# EAGLE design RFM98PW (EAGLE 9.6.2)
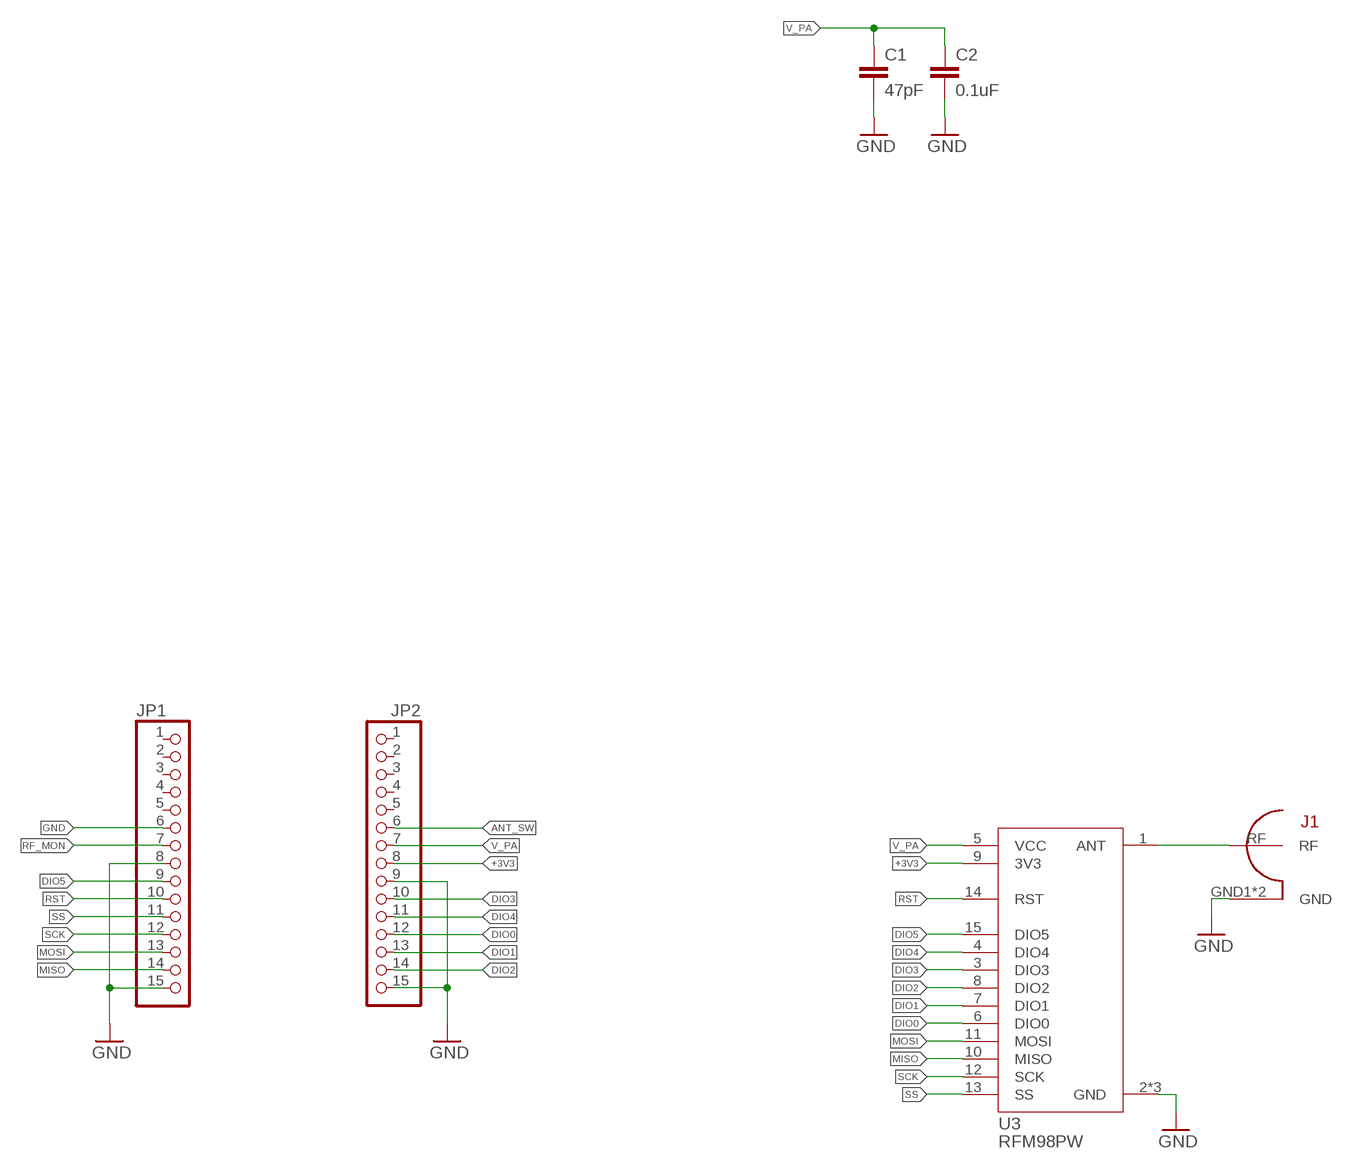
[diagram p0: schematic, sheet 1]

## Parts
C1  47pF  0603_CAPACITOR  [0603]
C2  0.1uF  0603_CAPACITOR  [0603]
J1  CON-SMA-EDGE-S  [CON-SMA-EDGE-S]
JP1  PINHD-1X15  [1X15]
JP2  PINHD-1X15  [1X15]
U3  RFM98PW  [RFM98PW]

## Nets
+3V3: JP2.8 U3.9(3V3)
ANT_SW: JP2.6
DIO0: JP2.12 U3.6(DIO0)
DIO1: JP2.13 U3.7(DIO1)
DIO2: JP2.14 U3.8(DIO2)
DIO3: JP2.10 U3.3(DIO3)
DIO4: JP2.11 U3.4(DIO4)
DIO5: JP1.9 U3.15(DIO5)
GND: C1.2 C2.2 J1.GND1(GND) J1.GND2(GND) JP1.6 JP1.8 JP1.15 JP2.9 JP2.15 U3.2(GND) U3.16(GND) U3.17(GND)
MISO: JP1.14 U3.10(MISO)
MOSI: JP1.13 U3.11(MOSI)
N$22 [RF]: J1.RF U3.1(ANT)
RF_MON: JP1.7
RST: JP1.10 U3.14(RST)
SCK: JP1.12 U3.12(SCK)
SS: JP1.11 U3.13(SS)
V_PA: C1.1 C2.1 JP2.7 U3.5(VCC)
Unconnected: JP1.1 JP1.2 JP1.3 JP1.4 JP1.5 JP2.1 JP2.2 JP2.3 JP2.4 JP2.5

## Library data of the parts
C1 C2 = ruark2:0603_CAPACITOR: 0603 Capacitor -- WARNING: NO DEFINED VALUE OR PART NUMBER; VALUE: sel
J1 = ruark2:CON-SMA-EDGE-S: SMA Connector Jack, Female Socket Board Edge, End Launch Solder; PARTNO: CON-SMA-EDGE-S-ND
JP1 JP2 = pinhead:PINHD-1X15: PIN HEADER
U3 = ruark2:RFM98PW: 433 MHz 1W LoRa Module

## Net classes
1 RF: clearance 0.127 mm

## Board
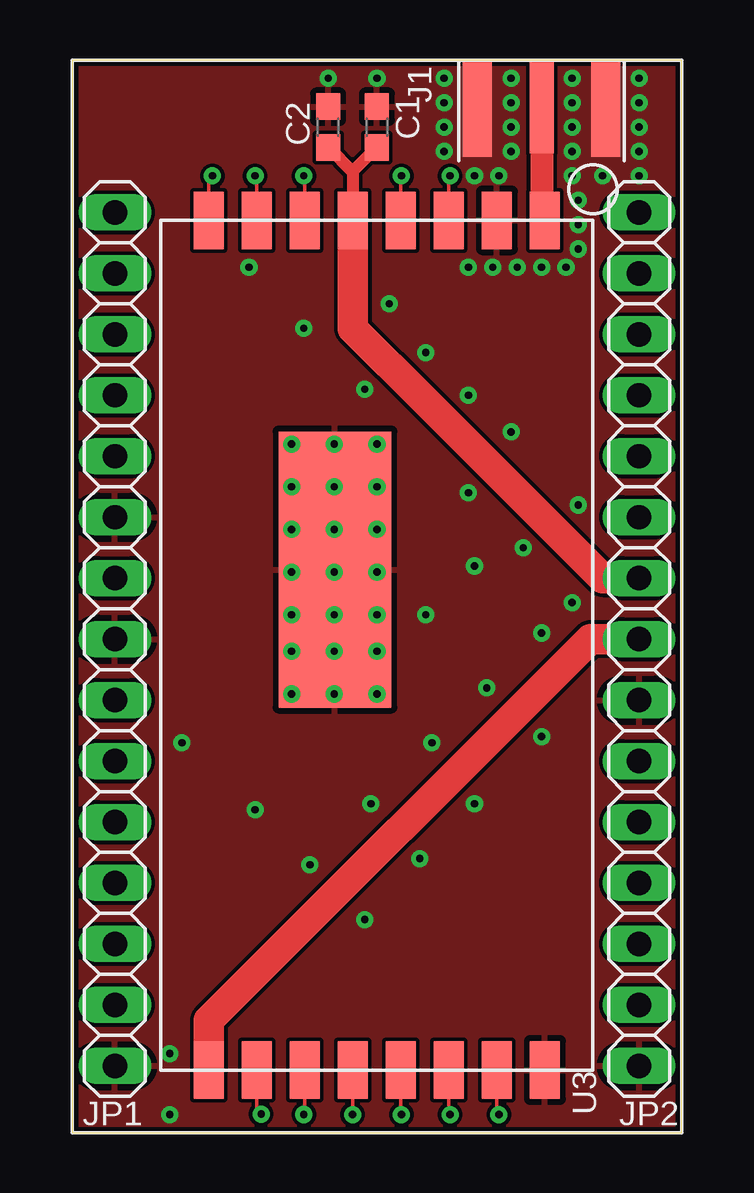
[diagram p1: board, top side]
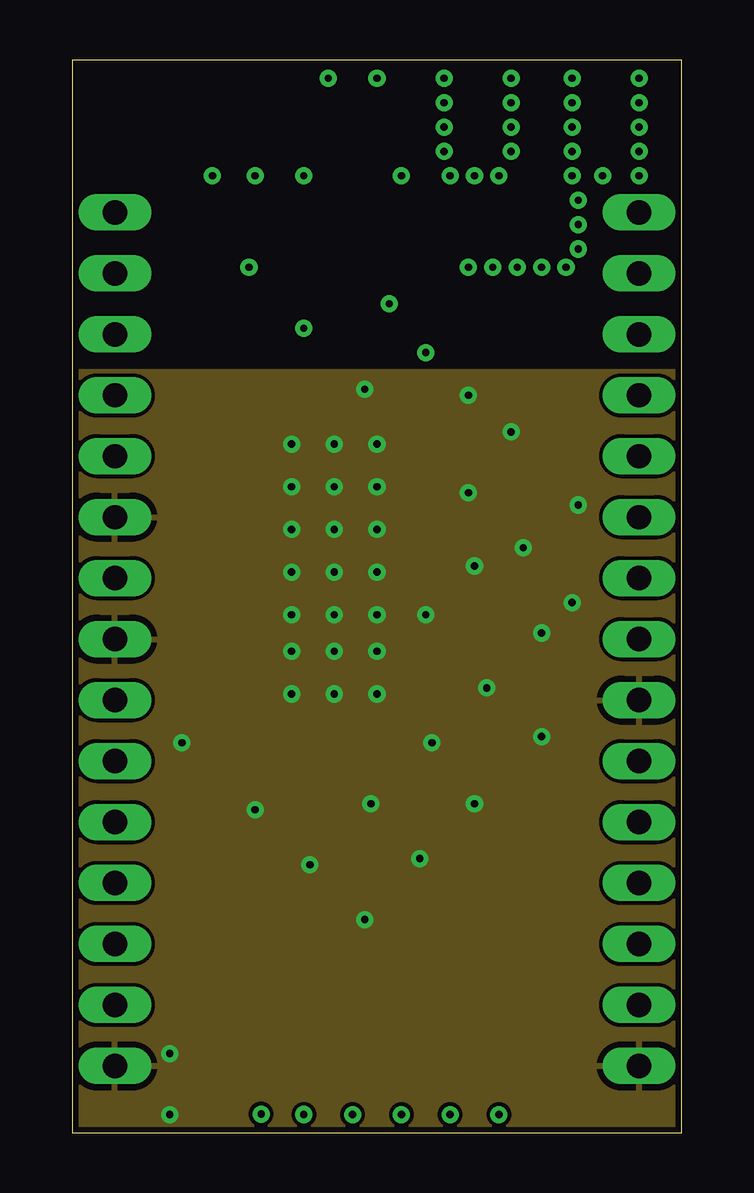
[diagram p2: board, inner layer Route2]
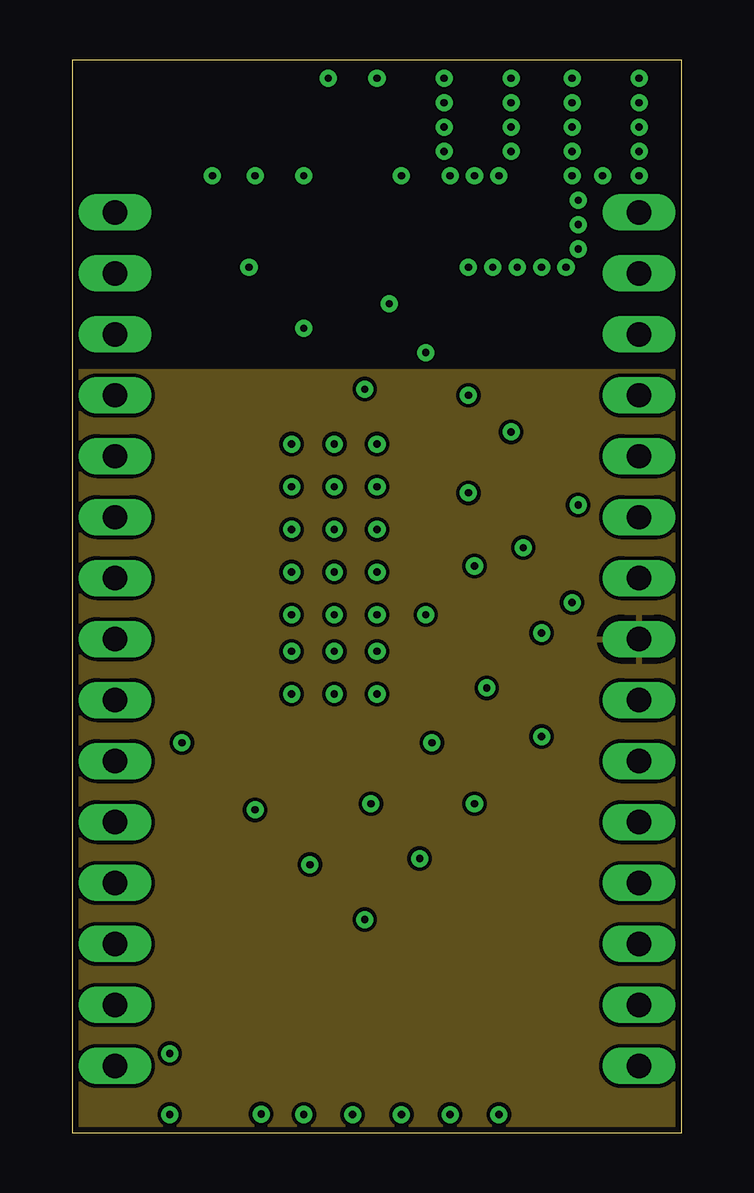
[diagram p3: board, inner layer Route15]
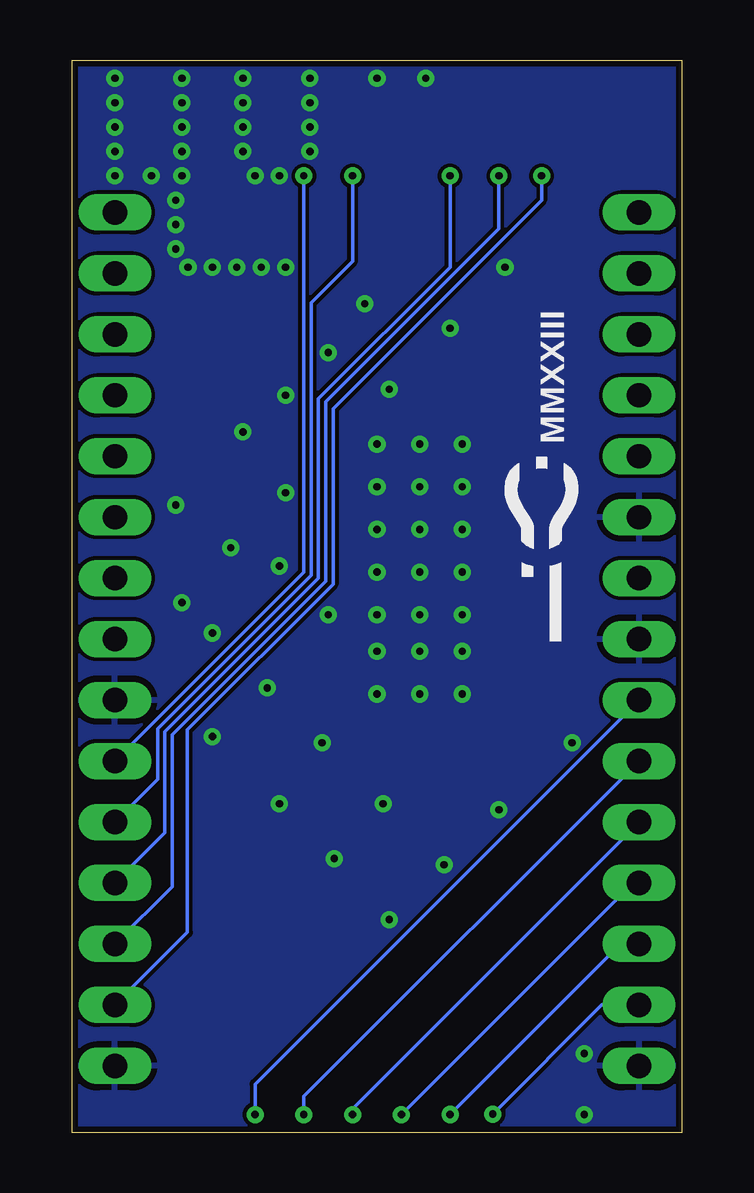
[diagram p4: board, bottom side, seen from below]

Size 25.4 x 44.7 mm. Coordinates in mm from the lower left corner, seen from the top.
Outline: 0,0 25.4,0 25.4,44.7 0,44.7 0,0
Copper layers (1+2*15+16): Top 0.035mm / dielectric 1.5mm / Route2 0.035mm / dielectric 0.15mm / Route15 0.035mm / dielectric 0.2mm / Bottom 0.035mm
Design rules "default *": minimum track width 6mil, minimum drill 12mil, track to track 6mil, track to pad 6mil, pad to pad 6mil, via to via 6mil, smd to smd 6mil, copper to edge 10mil, drill to drill 6mil, minimum pad ring 10mil, minimum via ring 8mil, stop-mask expansion 4mil, vias tented up to drill 12mil, thermal gap 10mil

### Footprints (pad centres in the part's own frame; a part is rotated, then mirrored left to right if it is on the bottom)
0603 = smd 1.1 x 1: 1 -0.85,0; 2 0.85,0
CON-SMA-EDGE-S = smd 1.2 x 4: GND1 -2.675,0; GND2 2.675,0 | smd 1 x 3.85: RF 0,0.075
1X15 = drill 1.016 long: 1 -17.78,0; 2 -15.24,0; 3 -12.7,0; 4 -10.16,0; 5 -7.62,0; 6 -5.08,0; 7 -2.54,0; 8 0,0; 9 2.54,0; 10 5.08,0; 11 7.62,0; 12 10.16,0; 13 12.7,0; 14 15.24,0; 15 17.78,0
RFM98PW = smd 2.4 x 1.25: 1 17.7,-7; 2 17.7,-5; 3 17.7,-3; 4 17.7,-1; 5 17.7,1; 6 17.7,3; 7 17.7,5; 8 17.7,7; 9 -17.7,7; 10 -17.7,5; 11 -17.7,3; 12 -17.7,1; 13 -17.7,-1; 14 -17.7,-3; 15 -17.7,-5; 16 -17.7,-7 | smd 11.5 x 4.7: 17 3.15,1.75

### Placement (x,y rotation side)
C1  12.7,41.91 90 top
C2  10.67,41.91 90 top
J1  19.56,42.67 0 top
JP1  1.78,20.57 270 top
JP2  23.62,20.57 270 top
U3  12.7,20.32 90 top

### Tracks (layer width: path | path; a pad name or v marks a point on that pad's centre or on a via)
+3V3
  Top 1.27: JP2.8 21.59,20.57 5.7,4.68 U3.9
  pour Route15: 0,0 25.4,0 25.4,31.75 0,31.75
DIO0  (via drill 0.3)
  Top 0.152: U3.6 9.7,39.83 v9.65,39.88
  Bottom 0.152: JP2.12 21.54,12.5 21.54,16.71 15.14,23.11 15.14,30.58 9.65,36.07 v9.65,39.88
DIO1  (via drill 0.3)
  Top 0.152: U3.7 7.7,39.8 v7.62,39.88
  Bottom 0.152: JP2.13 21.23,10.26 21.23,16.59 14.83,22.99 14.83,30.45 7.62,37.67 v7.62,39.88
DIO2  (via drill 0.3)
  Top 0.152: U3.8 5.7,39.74 v5.84,39.88
  Bottom 0.152: v5.84,39.88 5.84,38.86 14.53,30.18 14.53,22.86 20.6,16.79 20.6,8.36 JP2.14
DIO3  (via drill 0.3)
  Top 0.152: U3.3 15.7,39.83 v15.75,39.88
  Bottom 0.152: JP2.10 15.75,23.37 v15.75,39.88
DIO4  (via drill 0.3)
  Top 0.152: U3.4 13.7,39.86 v13.72,39.88
  Bottom 0.152: JP2.11 21.84,14.73 21.84,16.84 15.44,23.24 15.44,34.59 13.72,36.32 v13.72,39.88
DIO5  (via drill 0.3)
  Top 0.152: U3.15 17.7,0.84 v17.78,0.76
  Bottom 0.152: JP1.9 17.78,2.03 v17.78,0.76
GND  (via drill 0.3)
  other vias: 10.67,43.94 12.7,43.94 15.49,43.94 15.49,42.93 15.49,41.91 15.49,40.89 16.76,39.88 17.78,39.88 18.29,40.89 18.29,41.91 18.29,42.93 18.29,43.94 20.83,43.94 20.83,42.93 20.83,41.91 20.83,40.89 20.83,39.88 23.62,43.94 23.62,42.93 23.62,41.91 23.62,40.89 23.62,39.88 22.1,39.88 18.54,36.07 19.56,36.07 17.53,36.07 16.51,36.07 20.57,36.07 21.08,36.83 21.08,37.85 21.08,38.86 12.7,28.7 10.92,28.7 10.92,26.92 10.92,25.15 12.7,26.92 12.7,25.15 12.7,23.37 12.7,21.59 12.7,18.29 12.7,20.07 10.92,18.29 9.14,18.29 9.14,20.07 10.92,20.07 10.92,21.59 9.14,21.59 10.92,23.37 9.14,23.37 9.14,25.15 9.14,26.92 9.14,28.7 4.57,16.26 7.62,13.46 9.91,11.18 12.45,13.72 14.99,16.26 17.27,18.54 19.56,20.83 16.76,23.62 14.73,21.59 16.51,26.67 20.83,22.1 21.08,26.16 18.29,29.21 14.73,32.51 12.19,30.99 9.65,33.53 13.21,34.54 7.37,36.07 16.51,30.73 18.8,24.38 12.19,8.89 14.48,11.43 16.76,13.72 19.56,16.51 4.06,0.76 4.06,3.3
  pour Route2: 0,0 25.4,0 25.4,31.75 0,31.75
  pour Bottom: 0,0 25.4,0 25.4,44.7 0,44.7
  pour Top: 0,0 25.4,0 25.4,44.7 0,44.7
  pour Top (no thermals): 15.75,44.7 23.62,44.7 23.62,40.13 15.75,40.13
MISO  (via drill 0.3)
  Top 0.152: U3.10 7.7,0.96 v7.87,0.79
  Bottom 0.152: JP1.14 3.33,5.33 v7.87,0.79
MOSI  (via drill 0.3)
  Top 0.152: U3.11 9.7,0.81 v9.65,0.77
  Bottom 0.152: JP1.13 2.54,7.87 v9.65,0.77
N$22
  Top 0.965: J1.RF 19.56,38.16 U3.1
RST  (via drill 0.3)
  Top 0.152: U3.14 15.7,0.81 v15.75,0.76
  Bottom 0.152: JP1.10 15.75,1.52 v15.75,0.76
SCK  (via drill 0.3)
  Top 0.152: U3.12 11.7,0.78 v11.68,0.76
  Bottom 0.152: JP1.12 2.03,10.41 v11.68,0.76
SS  (via drill 0.3)
  Top 0.152: U3.13 13.7,0.78 v13.72,0.76
  Bottom 0.152: JP1.11 13.72,1.02 v13.72,0.76
V_PA
  Top 0.508: C2.1 11.7,40.03 U3.5 11.7,40.06 C1.1
  Top 1.27: U3.5 11.7,33.51 14.73,30.48 22.1,23.11 JP2.7

### Text on the board
bPlace: MMXXIII
bStop: 028